# Altium project SwakeUpp.PrjPcb
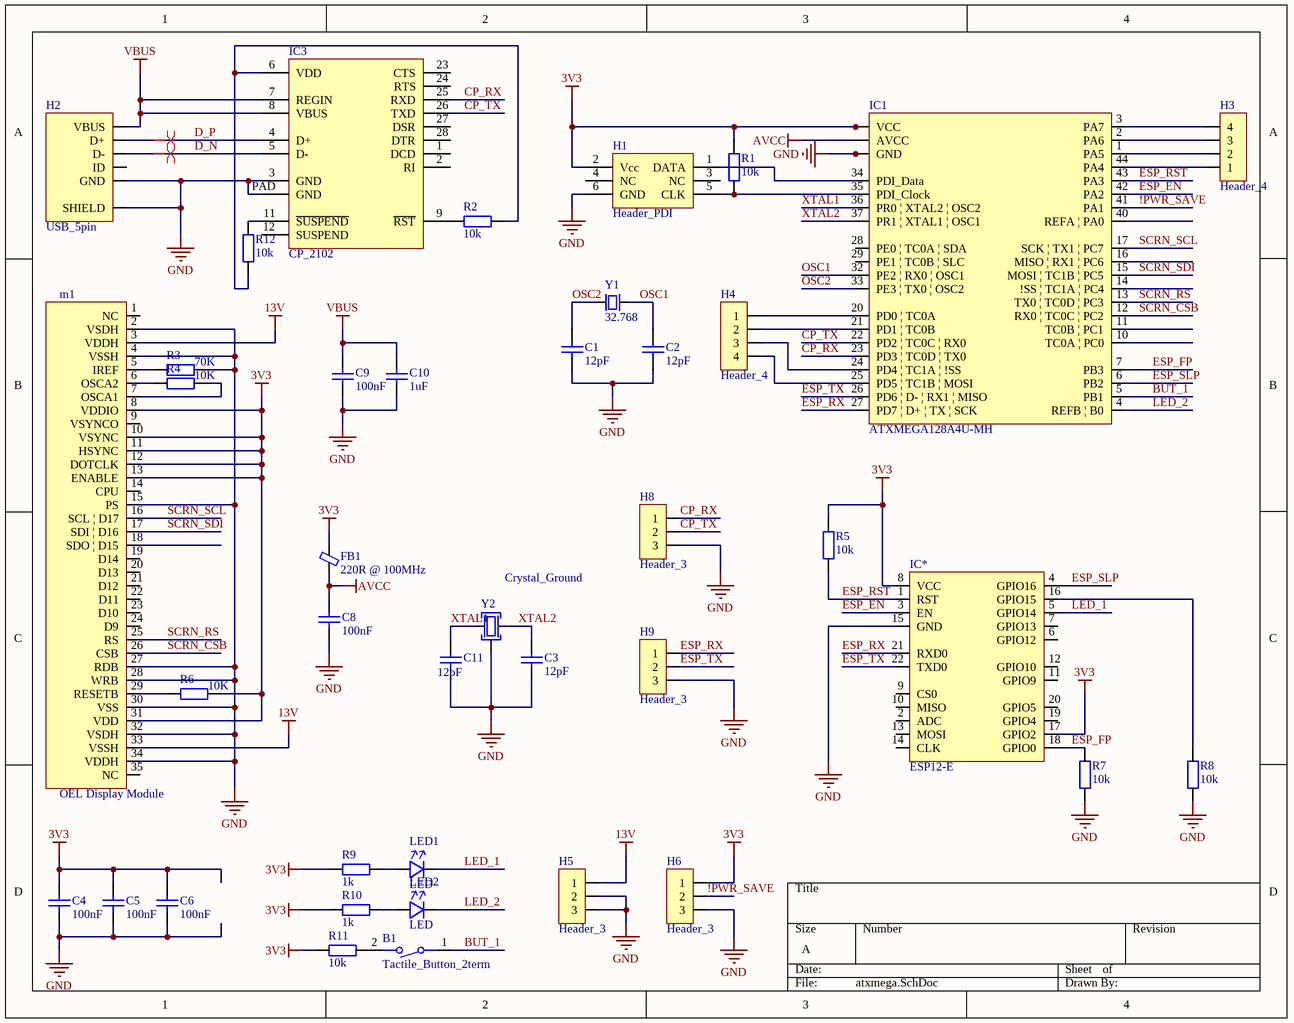
[diagram p0: atxmega.SchDoc]
1 sheet, 40 parts. Net scope: global (net labels, ports and power ports of the same name join across sheets).
Board file: atxmega.PcbDoc

## Sheet atxmega.SchDoc
size A

### Parts
B1  Tactile_Button_2term  [TACTILE_MINATUE_SMD_3.5x6mm]
C1  12pF  [C0402]
C2  12pF  [C0402]
C3  12pF  [C0402]
C4  100nF  [C0603]
C5  100nF  [C0603]
C6  100nF  [C0603]
C8  100nF  [C0603]
C9  100nF  [C0603]
C10  1uF  [C0603]
C11  12pF  [C0402]
FB1  220R @ 100MHz  [L0805]
H1  Header_PDI  [6-HEADER_BOXED]
H2  USB_5pin  [USB_Micro_B_RECEPTABLE_FCI]
H3  Header_4  [Header_MALE_4]
H4  Header_4  [Header_MALE_4]
H5  Header_3  [Header_MALE_3]
H6  Header_3  [Header_MALE_3]
H8  Header_3  [Header_MALE_3]
H9  Header_3  [Header_MALE_3]
IC1  ATXMEGA128A4U-MH  [44-VFQFN-E]
IC3  CP_2102  [28-QFN_Exposed_pad]
IC*  ESP12-E  [ESP12-E]
LED1  LED  [0603_LED]
LED2  LED  [0603_LED]
m1  OEL Display Module  [FFC-35-pin-0.5]
R1  10k  [R0603]
R2  10k  [R0603]
R3  70K  [R0603]
R4  10K  [R0603]
R5  10k  [R0603]
R6  10K  [R0603]
R7  10k  [R0603]
R8  10k  [R0603]
R9  1k  [R0603]
R10  1k  [R0603]
R11  10k  [R0603]
R12  10k  [R0603]
Y1  32.768  [crystal_6.2x2.1x2.1]
Y2  Crystal_Ground  [Crystal_3.2x2.5]

### Nets
3V3: C4.1 C5.1 C6.1 FB1.2 H1.2(Vcc) H6.1 IC1.9(VCC) IC1.19(VCC) IC1.31(VCC) IC*.8(VCC) IC*.17(GPIO2) m1.8(VDDIO) m1.10(VSYNC) m1.11(HSYNC) m1.12(DOTCLK) m1.13(ENABLE) m1.31(VDD) R1.1 R5.1 R6.1 R9.1 R10.1 R11.1
13V: H5.1 m1.3(VDDH) m1.33(VSSH)
AVCC: C8.1 FB1.1 IC1.39(AVCC)
GND: C1.2 C2.2 C3.2 C4.2 C5.2 C6.2 C8.2 C9.1 C10.1 C11.2 H1.6(GND) H2.5(GND) H2.SHIELD H5.2 H5.3 H6.3 H8.3 H9.3 IC1.8(GND) IC1.18(GND) IC1.30(GND) IC1.38(GND) IC1.45(GND) IC3.3(GND) IC3.PAD(GND) IC*.15(GND) m1.2(VSDH) m1.4(VSSH) m1.15(PS) m1.27(RDB) m1.28(WRB) m1.30(VSS) m1.32(VSDH) m1.34(VDDH) R3.1 R7.2 R8.2 Y2.2
VBUS: C9.2 C10.2 H2.1(VBUS) IC3.7(REGIN) IC3.8(VBUS)
!PWR_SAVE: H6.2 IC1.41(PA1)
BUT_1: B1.1 IC1.5(PB1)
CP_RX: H8.1 IC1.23(PD3_|_TC0D_|_TX0) IC3.25(RXD)
CP_TX: H8.2 IC1.22(PD2_|_TC0C_|_RX0) IC3.26(TXD)
D_N: H2.2(D-) IC3.5(D-)
D_P: H2.3(D+) IC3.4(D+)
ESP_EN: IC1.42(PA2) IC*.3(EN)
ESP_FP: IC1.7(PB3) IC*.18(GPIO0) R7.1
ESP_RST: IC1.43(PA3) IC*.1(RST) R5.2
ESP_RX: H9.1 IC1.27(PD7_|_D+_|_TX_|_SCK) IC*.21(RXD0)
ESP_SLP: IC1.6(PB2) IC*.4(GPIO16)
ESP_TX: H9.2 IC1.26(PD6_|_D-_|_RX1_|_MISO) IC*.22(TXD0)
LED_1: IC*.5(GPIO14) LED1.C(Cathode)
LED_2: IC1.4(REFB_|_B0) LED2.C(Cathode)
OSC1: C2.1 IC1.32(PE2_|_RX0_|_OSC1) Y1.0(XTAL2)
OSC2: C1.1 IC1.33(PE3_|_TX0_|_OSC2) Y1.1(XTAL1)
SCRN_CSB: IC1.12(RX0_|_TC0C_|_PC2) m1.26(CSB)
SCRN_RS: IC1.13(TX0_|_TC0D_|_PC3) m1.25(RS)
SCRN_SCL: IC1.17(SCK_|_TX1_|_PC7) m1.16(SCL_|_D17)
SCRN_SDI: IC1.15(MOSI_|_TC1B_|_PC5) m1.17(SDI_|_D16)
XTAL1: C11.1 IC1.36(PR0_|_XTAL2_|_OSC2) Y2.1
XTAL2: C3.1 IC1.37(PR1_|_XTAL1_|_OSC1) Y2.3
NetB1_2: B1.2 R11.2
NetH1_1: H1.1(DATA) IC1.34(PDI_Data)
NetH1_5: H1.5(CLK) IC1.35(PDI_Clock) R1.2
NetH3_1: H3.1 IC1.44(PA4)
NetH3_2: H3.2 IC1.1(PA5)
NetH3_3: H3.3 IC1.2(PA6)
NetH3_4: H3.4 IC1.3(PA7)
NetH4_1: H4.1 IC1.20(PD0_|_TC0A)
NetH4_2: H4.2 IC1.21(PD1_|_TC0B)
NetH4_3: H4.3 IC1.24(PD4_|_TC1A_|_!SS)
NetH4_4: H4.4 IC1.25(PD5_|_TC1B_|_MOSI)
NetIC3_6: IC3.6(VDD) R2.1 R12.2
NetIC3_9: IC3.9(~{RST}) R2.2
NetIC3_11: IC3.11(~{SUSPEND}) R12.1
NetIC*_16: IC*.16(GPIO15) R8.1
NetLED1_A: LED1.A(Anode) R9.2
NetLED2_A: LED2.A(Anode) R10.2
Netm1_5: m1.5(IREF) R3.2
Netm1_6: m1.6(OSCA2) R4.2
Netm1_7: m1.7(OSCA1) R4.1
Netm1_29: m1.29(RESETB) R6.2

Not connected (* = marked no-connect by the designer): H1 3(NC) 4(NC); H2 4(ID); IC1 10(TC0A_|_PC0) 11(TC0B_|_PC1) 14(!SS_|_TC1A_|_PC4) 16(MISO_|_RX1_|_PC6) 28(PE0_|_TC0A_|_SDA) 29(PE1_|_TC0B_|_SLC) 40(REFA_|_PA0); IC3 1(DCD) 2(RI) 12(SUSPEND) 23(CTS) 24(RTS) 27(DSR) 28(DTR); IC* 2(ADC) 6(GPIO12) 7(GPIO13) 9(CS0) 10(MISO) 11(GPIO9) 12(GPIO10) 13(MOSI) 14(CLK) 19(GPIO4) 20(GPIO5); m1 1(NC) 9(VSYNCO) 14(CPU) 18(SDO_|_D15) 19(D14) 20(D13) 21(D12) 22(D11) 23(D10) 24(D9) 35(NC)

### Layout directives
differential pair: D_N, D_P

### Library data of the parts
C1-C6 C8-C11 = Capacitor: Schematic symbol of a capacitor
FB1 = Ferrite
H1 = Header_PDI: 6-pin Boxed header with pinout used for PDI programming by Atmel programmers; Supplier 1: Digi-Key; Supplier Part Number 1: 3M15451-ND
H2 = USB_5pin: 5 Pins USB Connector; Supplier 1: Digi-Key; Supplier 2: Digi-Key; Supplier Part Number 1: 609-4616-1-ND; Supplier Part Number 2: 151-1206-1-ND
H3 H4 = Header_4: Generic 4pin header symbol; Supplier 1: Digi-Key; Supplier Part Number 1: S1012EC-40-ND
H5 H6 H8 H9 = Header_3: Generic 3pin header symbol; Supplier 1: Digi-Key; Supplier Part Number 1: S1012EC-40-ND
IC1 = ATXMEGA128A4U-MH: AVR AVR® XMEGA® A4U Microcontroller IC 8/16-Bit 32MHz 128KB (64K x 16) FLASH 44-VQFN (7x7); Digikey: ATXMEGA128A4U-MH-ND
IC3 = CP_2102: Single chip USB to UART Bridge; Supplier 1: Digi-Key; Supplier Part Number 1: 336-1160-1-ND
LED1 LED2 = LED: Schematic symbol of a LED
m1 = OEL Display Module: Part ID: UG-6028GDEAF01
R1-R12 = Resistor: Schematic symbol of a resistor
Y1 = Abracon LLC AB26T-32.768KHZ: 32.768kHz ±20ppm Crystal 12.5pF 35 kOhm -10°C ~ 60°C Through Hole Cylindrical Can, Radial
Y2 = Crystal_Ground: Schematic symbol of a 2pin crystal with case connection